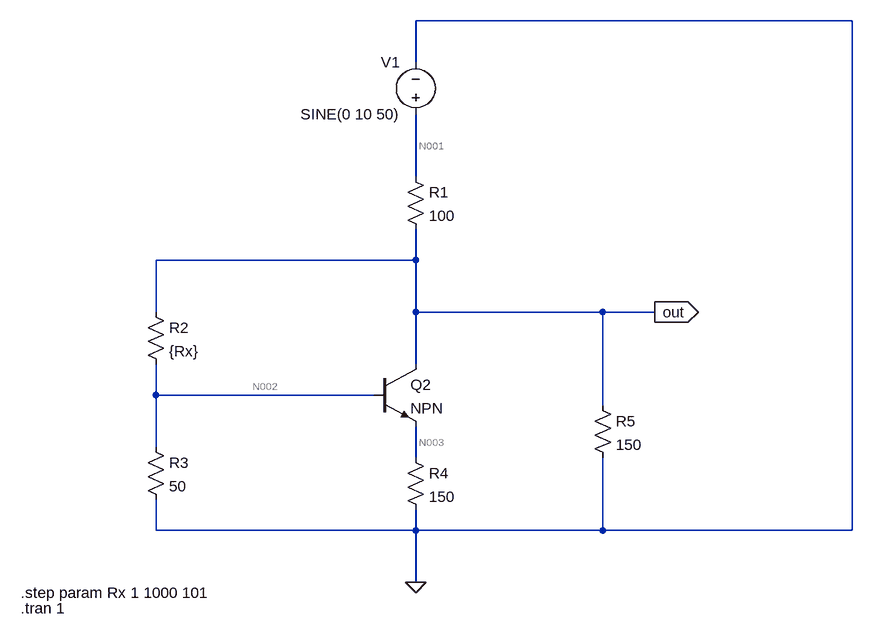
[diagram p0: schematic amp1.asc]
amp1.asc, the LTspice schematic file:
Version 4.1
SHEET 1 880 680
WIRE 544 -336 -128 -336
WIRE -128 -272 -128 -336
WIRE -128 -96 -128 -192
WIRE -128 32 -128 -16
WIRE -128 32 -528 32
WIRE -528 112 -528 32
WIRE -128 112 -128 32
WIRE 160 112 -128 112
WIRE 240 112 160 112
WIRE -128 192 -128 112
WIRE -528 240 -528 192
WIRE -192 240 -528 240
WIRE 160 256 160 112
WIRE -528 320 -528 240
WIRE -128 336 -128 288
WIRE -528 448 -528 400
WIRE -128 448 -128 416
WIRE -128 448 -528 448
WIRE 160 448 160 336
WIRE 160 448 -128 448
WIRE 544 448 544 -336
WIRE 544 448 160 448
WIRE -128 528 -128 448
FLAG -128 528 0
FLAG 240 112 out
IOPIN 240 112 Out
SYMBOL voltage -128 -176 R180
WINDOW 0 24 96 Left 2
WINDOW 3 24 16 Left 2
WINDOW 123 0 0 Left 0
WINDOW 39 0 0 Left 0
SYMATTR InstName V1
SYMATTR Value SINE(0 10 50)
SYMBOL res -144 -112 R0
SYMATTR InstName R1
SYMATTR Value 100
SYMBOL res -544 96 R0
SYMATTR InstName R2
SYMATTR Value {Rx}
SYMBOL npn -192 192 R0
SYMATTR InstName Q2
SYMBOL res -544 304 R0
SYMATTR InstName R3
SYMATTR Value 50
SYMBOL res -144 320 R0
SYMATTR InstName R4
SYMATTR Value 150
SYMBOL res 144 240 R0
SYMATTR InstName R5
SYMATTR Value 150
TEXT -736 544 Left 2 !.step param Rx 1 1000 101
TEXT -736 568 Left 2 !.tran 1

The netlist it stands for:
* amp1.asc
V1 N001 0 SINE(0 10 50)
R1 N001 out 100
R2 out N002 {Rx}
Q2 out N002 N003 0 NPN
R3 N002 0 50
R4 N003 0 150
R5 out 0 150
.model NPN NPN
.model PNP PNP
.lib standard.bjt
.step param Rx 1 1000 101
.tran 1
.backanno
.end

* Results of the author's LTspice run, read from the files saved beside the schematic
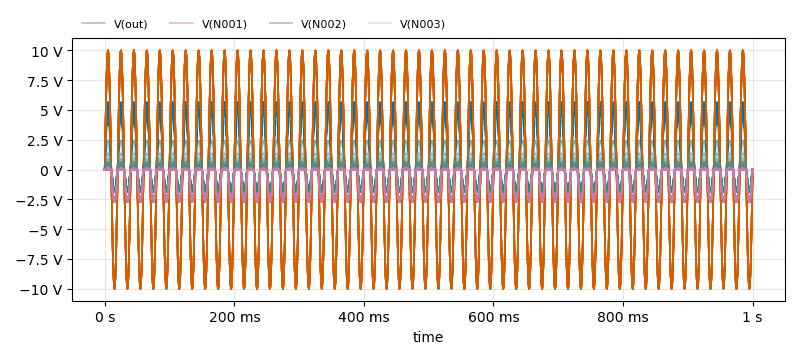
[diagram p1: Transient Analysis of amp1.asc, plotted from the saved traces]
* Transient Analysis, 11 runs:
*   V(out) [rx=1]: min -2.757 V, max 2.466 V, average -76.5 mV, rms 1.862 V, last 0 V
*   V(out) [rx=100.9]: min -2.709 V, max 4.134 V, average 401.6 mV, rms 2.527 V, last 0 V
*   V(out) [rx=200.8]: min -2.71 V, max 4.785 V, average 603 mV, rms 2.794 V, last 0 V
*   V(out) [rx=300.7]: min -2.71 V, max 5.118 V, average 701.2 mV, rms 2.93 V, last 0 V
*   V(out) [rx=400.6]: min -2.71 V, max 5.295 V, average 756.3 mV, rms 3.006 V, last 0 V
*   V(out) [rx=500.5]: min -2.71 V, max 5.41 V, average 793.1 mV, rms 3.057 V, last 0 V
*   V(out) [rx=600.4]: min -2.71 V, max 5.493 V, average 819.6 mV, rms 3.094 V, last 0 V
*   V(out) [rx=700.3]: min -2.71 V, max 5.556 V, average 839.5 mV, rms 3.122 V, last 0 V
*   V(N001) [rx=1]: min -10 V, max 10 V, average 691.3 µV, rms 7.082 V, last 0 V
*   V(N001) [rx=100.9]: min -10 V, max 10 V, average -682.8 µV, rms 7.082 V, last 0 V
*   V(N001) [rx=200.8]: min -10 V, max 9.998 V, average -1.322 mV, rms 7.08 V, last 0 V
*   V(N001) [rx=300.7]: min -10 V, max 10 V, average -810.2 µV, rms 7.081 V, last 0 V
*   V(N001) [rx=400.6]: min -10 V, max 10 V, average -981.5 µV, rms 7.08 V, last 0 V
*   V(N001) [rx=500.5]: min -10 V, max 10 V, average -928.8 µV, rms 7.08 V, last 0 V
*   V(N001) [rx=600.4]: min -10 V, max 10 V, average -928.8 µV, rms 7.08 V, last 0 V
*   V(N001) [rx=700.3]: min -10 V, max 10 V, average -928.8 µV, rms 7.08 V, last 0 V
*   V(N002) [rx=1]: min -2.703 V, max 2.418 V, average -75.03 mV, rms 1.826 V, last 0 V
*   V(N002) [rx=100.9]: min -1.848 V, max 1.368 V, average -109.8 mV, rms 1.124 V, last 0 V
*   V(N002) [rx=200.8]: min -1.846 V, max 953.4 mV, average -231.7 mV, rms 999.1 mV, last 0 V
*   V(N002) [rx=300.7]: min -1.845 V, max 729.7 mV, average -300.7 mV, rms 947.9 mV, last 0 V
*   V(N002) [rx=400.6]: min -1.844 V, max 587.5 mV, average -344.1 mV, rms 921.8 mV, last 0 V
*   V(N002) [rx=500.5]: min -1.844 V, max 491.4 mV, average -373.6 mV, rms 907.1 mV, last 0 V
*   V(N002) [rx=600.4]: min -1.844 V, max 422.3 mV, average -394.8 mV, rms 898.1 mV, last 0 V
*   V(N002) [rx=700.3]: min -1.844 V, max 370.2 mV, average -410.9 mV, rms 892.1 mV, last 0 V
*   V(N003) [rx=1]: min -376.5 nV, max 1.583 V, average 417.4 mV, rms 721.7 mV, last 0 V
*   V(N003) [rx=100.9]: min -2.683 V, max 560.4 mV, average -675.7 mV, rms 1.349 V, last 0 V
*   V(N003) [rx=200.8]: min -2.689 V, max 175.4 mV, average -814.3 mV, rms 1.364 V, last 0 V
*   V(N003) [rx=300.7]: min -2.69 V, max 15.1 mV, average -852.2 mV, rms 1.372 V, last 0 V
*   V(N003) [rx=400.6]: min -2.691 V, max 110.6 µV, average -859.9 mV, rms 1.375 V, last 0 V
*   V(N003) [rx=500.5]: min -2.691 V, max 2.7 µV, average -863.5 mV, rms 1.377 V, last 0 V
*   V(N003) [rx=600.4]: min -2.692 V, max 938.9 nV, average -865.8 mV, rms 1.379 V, last 0 V
*   V(N003) [rx=700.3]: min -2.692 V, max 291.7 nV, average -867.4 mV, rms 1.38 V, last 0 V